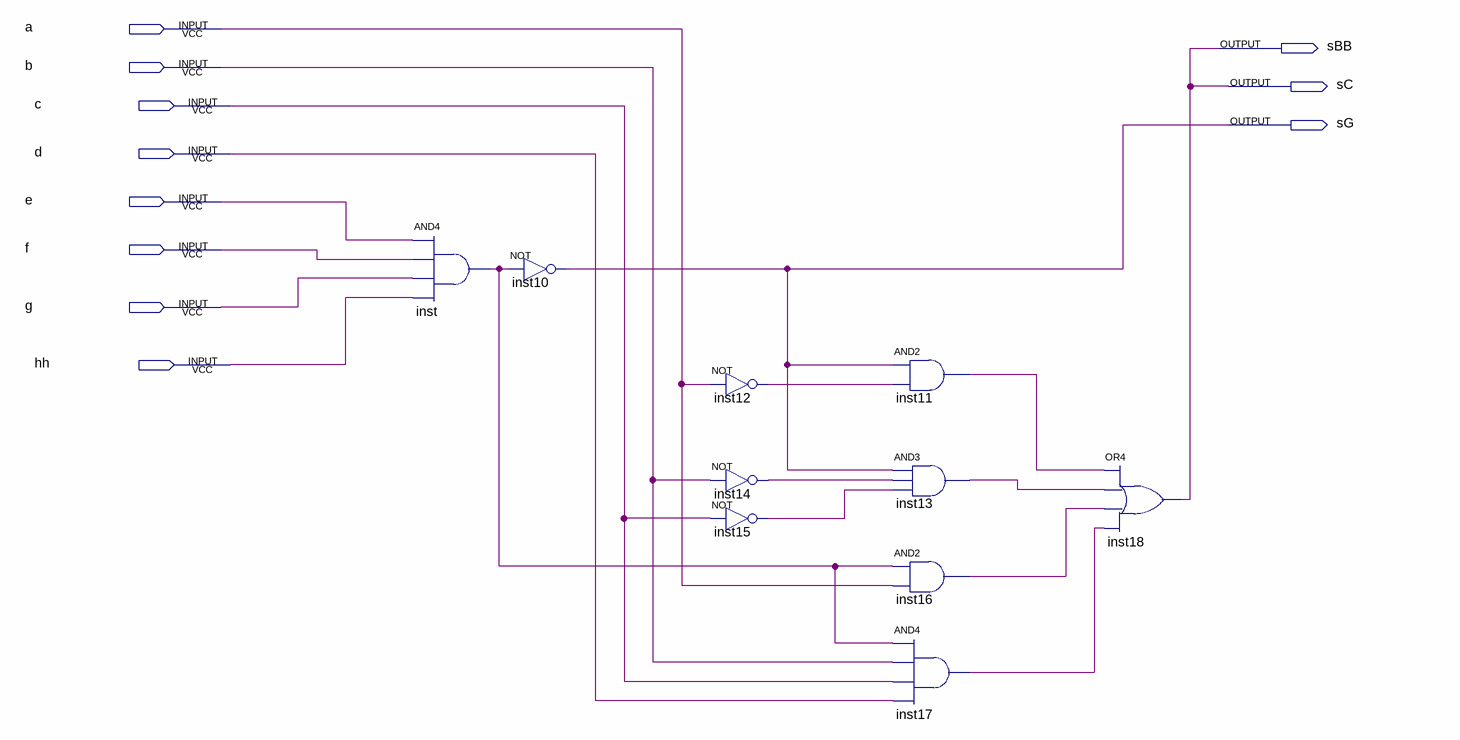
[diagram p0: schematic sheet]
// Quartus schematic dec_result_dezena.bdf as structural Verilog: 10 symbols, 11 pins
module dec_result_dezena (
  input  a,
  input  b,
  input  c,
  input  d,
  input  e,
  input  f,
  input  g,
  input  hh,
  output sBB,
  output sC,
  output sG
);

  wire inst11_out, inst12_out, inst13_out, inst14_out, inst15_out, inst16_out, inst17_out, inst_out;

  and inst (inst_out, e, f, g, hh);
  not inst10 (sG, inst_out);
  not inst12 (inst12_out, a);
  not inst14 (inst14_out, b);
  not inst15 (inst15_out, c);
  and inst11 (inst11_out, sG, inst12_out);
  and inst13 (inst13_out, sG, inst14_out, inst15_out);
  and inst16 (inst16_out, inst_out, a);
  and inst17 (inst17_out, inst_out, b, c, d);
  or inst18 (sBB, inst11_out, inst13_out, inst16_out, inst17_out);

  assign sC = sBB;
endmodule
